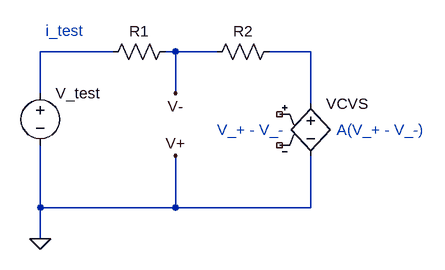
[diagram p0: schematic non_inverting_amp_R_in.asc]
non_inverting_amp_R_in.asc, the LTspice schematic file:
Version 4
SHEET 1 880 680
WIRE 128 64 16 64
WIRE 224 64 208 64
WIRE 288 64 224 64
WIRE 432 64 368 64
WIRE 16 128 16 64
WIRE 224 128 224 64
WIRE 432 144 432 64
WIRE 16 304 16 208
WIRE 224 304 224 224
WIRE 224 304 16 304
WIRE 432 304 432 224
WIRE 432 304 224 304
WIRE 16 352 16 304
FLAG 16 352 0
FLAG 224 128 V-
FLAG 224 224 V+
SYMBOL voltage 16 112 R0
SYMATTR InstName V_test
SYMATTR Value ""
SYMBOL res 112 80 R270
WINDOW 0 32 56 VTop 2
WINDOW 3 0 56 VBottom 2
SYMATTR InstName R1
SYMATTR Value ""
SYMBOL res 272 80 R270
WINDOW 0 32 56 VTop 2
WINDOW 3 0 56 VBottom 2
SYMATTR InstName R2
SYMATTR Value ""
SYMBOL e 432 128 R0
SYMATTR InstName VCVS
SYMATTR Value ""
TEXT 288 184 Left 2 ;V_+ - V_-
TEXT 472 184 Left 2 ;A(V_+ - V_-)
TEXT 24 32 Left 2 ;i_test

The netlist it stands for:
* non_inverting_amp_R_in.asc
V_test N001 0
R1 N001 V-
R2 V- N002
E§VCVS N002 0 NC_01 NC_02
* V_+ - V_-
* A(V_+ - V_-)
* i_test
.backanno
.end